# Altium schematic sheet Probe.SchDoc: FET Active Probe
size A4; DocumentNumber: 1; SheetNumber: 1; SheetTotal: 2
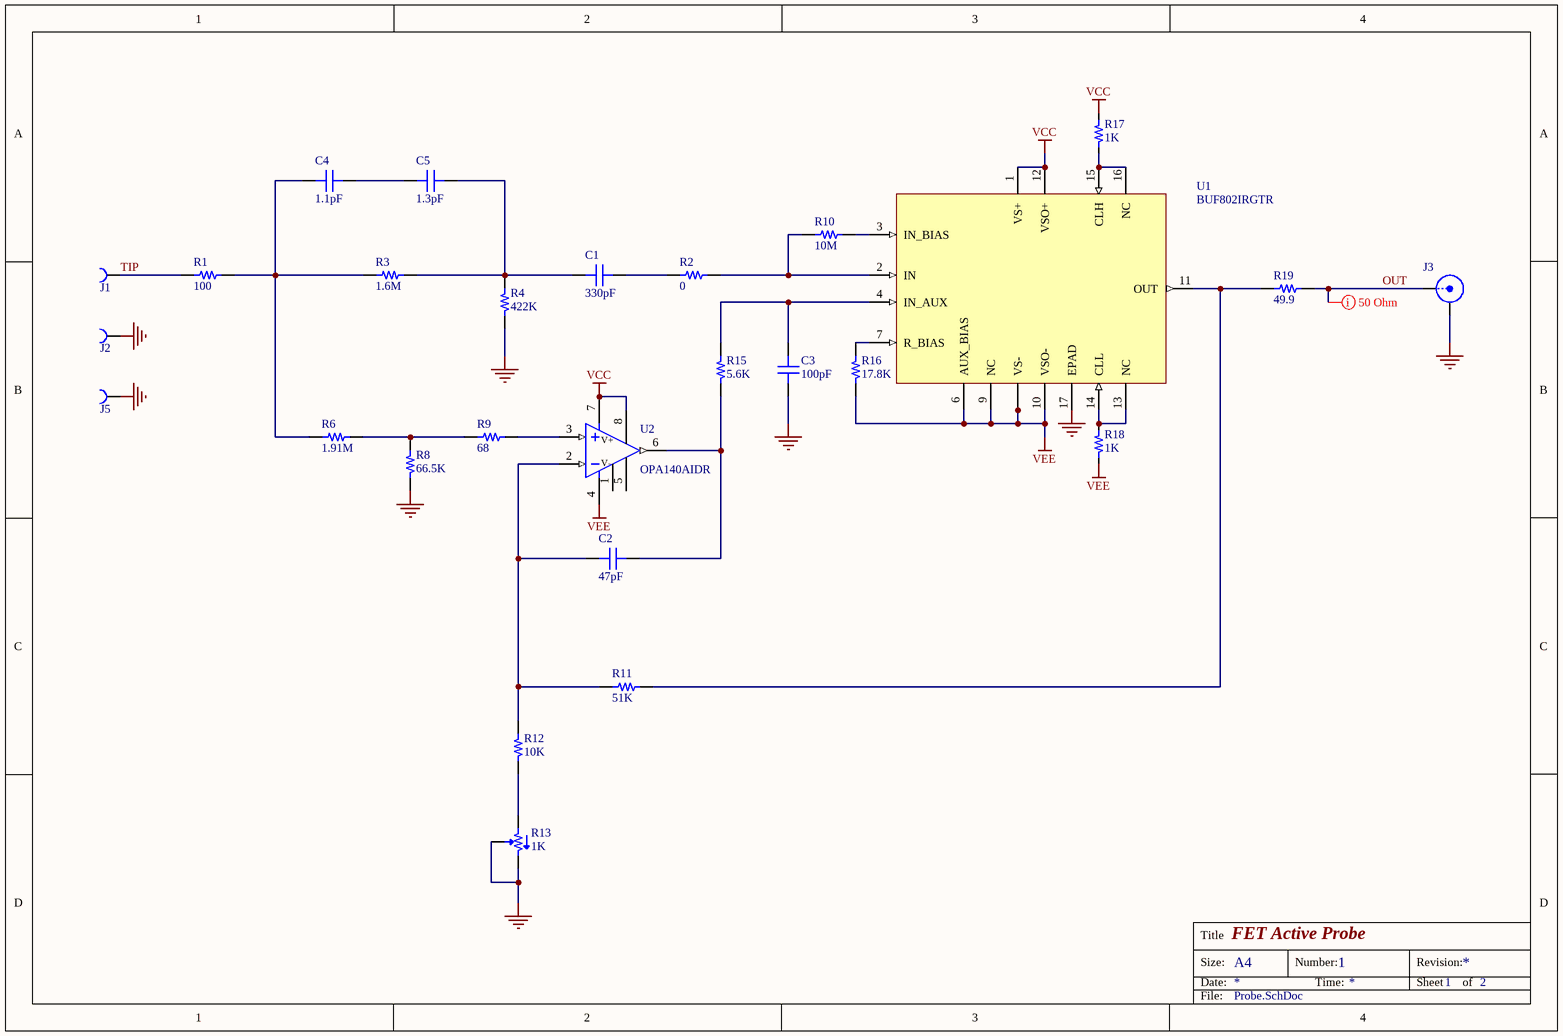
[diagram p0: Probe.SchDoc]

## Parts
C1  330pF  [CAP 0402/1005]
C2  47pF  [CAP 0402/1005]
C3  100pF  [CAP 0402/1005]
C4  1.1pF  [CAP 0402/1005 RF]
C5  1.3pF  [CAP 0402/1005 RF]
J1  0339-0-15-01-15-27-10-0  [MILL-MAX 0339]  (value not drawn)
J2  0339-0-15-01-15-27-10-0  [MILL-MAX 0339]  (value not drawn)
J3  CONN SMA JACK EDGE MNT  [60312202114513]  (value not drawn)
J5  0339-0-15-01-15-27-10-0  [MILL-MAX 0339]  (value not drawn)
R1  100  [RES 0402/1005]
R2  0  [RES 0402/1005]
R3  1.6M  [RES 0402/1005]
R4  422K  [RES 0402/1005]
R6  1.91M  [RES 0402/1005]
R8  66.5K  [RES 0402/1005]
R9  68  [RES 0402/1005]
R10  10M  [RES 0402/1005]
R11  51K  [RES 0402/1005]
R12  10K  [RES 0402/1005]
R13  1K  [BOURNS 3224W]
R15  5.6K  [RES 0402/1005]
R16  17.8K  [RES 0402/1005]
R17  1K  [RES 0402/1005]
R18  1K  [RES 0402/1005]
R19  49.9  [RES 0402/1005]
U1  BUF802IRGTR  [QFN50P305X305X100_HS-17N]
U2  OPA140AIDR  [TI SOIC-8 D]

## Nets
GND: C3.2 J2.1 J3.2(Y) J5.1 R4.2 R8.2 R13.2 R13.3 U1.17(EPAD)
VCC: R17.2 U1.1(VS+) U1.12(VSO+) U2.7(V+) U2.8
VEE: R16.2 R18.2 U1.5(VS-) U1.6(AUX_BIAS) U1.8(VS-) U1.9(NC) U1.10(VSO-) U2.4(V-)
OUT: J3.1(X) R19.2
TIP: J1.1 R1.1
NetC1_1: C1.1 C5.2 R3.2 R4.1
NetC1_2: C1.2 R2.1
NetC2_1: C2.1 R11.1 R12.1 U2.2(-IN)
NetC2_2: C2.2 R15.2 U2.6(OUT)
NetC3_1: C3.1 R15.1 U1.4(IN_AUX)
NetC4_1: C4.1 R1.2 R3.1 R6.1
NetC4_2: C4.2 C5.1
NetR2_2: R2.2 R10.1 U1.2(IN)
NetR6_2: R6.2 R8.1 R9.1
NetR9_2: R9.2 U2.3(+IN)
NetR10_2: R10.2 U1.3(IN_BIAS)
NetR11_2: R11.2 R19.1 U1.11(OUT)
NetR12_2: R12.2 R13.1
NetR16_1: R16.1 U1.7(R_BIAS)
NetR17_1: R17.1 U1.15(CLH) U1.16(NC)
NetR18_1: R18.1 U1.13(NC) U1.14(CLL)

Not connected (* = marked no-connect by the designer): U2 1 5(10)

## Layout directives
rule Width Constraint [Pref Impedance = 50.00ohms    Min Impedance = 50.00ohms    Max Impedance = 50.00ohms]: OUT

## Notes on the sheet
- Title
- Size:
- Date:
- A4
- Number:
- Time:
- Revision:
- Sheet
- of
- File:

## Library data of the parts
C1 = CM0293: CAP CER 330PF 50V NP0 0402; Manufacturer: Murata; Part Number: GRM1555C1H331JA01D; Tolerance: 5%; TemperatureRange: -55C ~ 125C; TemperatureCoefficient: C0G, NP0; Value: 330pF; PartId: CM0293; Supplier 1: Digi-Key; Supplier Part Number 1: 490-1295-2-ND; ComponentLink1Description: Datasheet; ComponentLink1URL: http://www.murata.com/~/media/webrenewal/support/library/catalog/products/capacitor/mlcc/c02e.ashx; ComponentLink2Description: Digi-Key listing; ComponentLink2URL: http://digikey.com/product-detail/en/GRM1555C1H331JA01D/490-1295-2-ND/587206; Voltage: 50V; Price: 0.009; Type: -; Device Package: 0402 (1005 Metric)
C2 = CM0224: CAP CER 47PF 50V NP0 0402; Manufacturer: Murata; Part Number: GRM1555C1H470FA01D; Tolerance: 1%; TemperatureRange: -55C ~ 125C; TemperatureCoefficient: C0G, NP0; Value: 47pF; PartId: CM0224; Supplier 1: Digi-Key; Supplier Part Number 1: 490-6241-2-ND; ComponentLink1Description: Datasheet; ComponentLink1URL: http://www.murata.com/~/media/webrenewal/support/library/catalog/products/capacitor/mlcc/c02e.ashx; ComponentLink2Description: Digi-Key listing; ComponentLink2URL: http://digikey.com/product-detail/en/GRM1555C1H470FA01D/490-6241-2-ND/3693991; Voltage: 50V; Price: 0.0133; Type: -; Device Package: 0402 (1005 Metric)
C3 = CM0248: CAP CER 100PF 50V NP0 0402; Manufacturer: Murata; Part Number: GRM1555C1H101FA01D; Tolerance: 1%; TemperatureRange: -55C ~ 125C; TemperatureCoefficient: C0G, NP0; Value: 100pF; PartId: CM0248; Supplier 1: Digi-Key; Supplier Part Number 1: 490-8180-2-ND; ComponentLink1Description: Datasheet; ComponentLink1URL: http://www.murata.com/~/media/webrenewal/support/library/catalog/products/capacitor/mlcc/c02e.pdf; ComponentLink2Description: Digi-Key Listing; ComponentLink2URL: https://www.digikey.com/product-detail/en/murata-electronics-north-america/GRM1555C1H101FA01D/490-8180-2-ND/3693919; Voltage: 50V; Price: 0.0092; Device Package: 0402 (1005 Metric)
C4 = CR1657: CAP CER 1.1PF +-0.05PF 50V NP0 0201; Part Number: GJM1555C1H1R1WB01D; Manufacturer: Murata; TemperatureRange: -55C ~ 125C; TemperatureCoefficient: C0G, NP0; Type: High Q, Low Loss; Tolerance: 0.05pF; Value: 1.1pF; PartId: CR1657; Supplier 1: Mouser; Supplier Part Number 1: 81-GJM1555C1H1R1WB01D; ComponentLink1Description: Datasheet; Voltage: 50V; Price: 0.02; Device Package: 0402 (1005 Metric); ComponentLink1URL: https://www.murata.com/en-eu/products/capacitor/ceramiccapacitor/overview/lineup/smd/gjm
C5 = CR1663: CAP CER 1.3PF +-0.05PF 50V NP0 0201; Part Number: GJM1555C1H1R3WB01D; Manufacturer: Murata; Tolerance: 0.05pF; TemperatureRange: -55C ~ 125C; TemperatureCoefficient: C0G, NP0; Type: High Q, Low Loss; Value: 1.3pF; PartId: CR1663; Supplier 1: Mouser; Supplier Part Number 1: 81-GJM1555C1H1R3WB01D; ComponentLink1Description: Datasheet; ComponentLink1URL: https://www.murata.com/en-eu/products/capacitor/ceramiccapacitor/overview/lineup/smd/gjm; Voltage: 50V; Price: 0.02; Device Package: 0402 (1005 Metric)
J1 J2 J5 = 0339-0-15-01-15-27-10-0: CONN PIN RCPT; Manufacturer: Mill-Max; Supplier 1: Digi-Key; Supplier Part Number 1: 0339-0-15-01-15-27-10-0-ND; Part Number: 0339-0-15-01-15-27-10-0; Stock 1: 989; Pricing 1: 1=1.42, 10=1.234, 25=1.1812, 50=1.155, 100=1.1025, 250=0.99748, 500=0.91874, 1000=0.7875, 2500=0.735 (USD); Contact Material: Copper; Contact Plating: Gold; Min Operating Temperature: -55°C; Max Operating Temperature: 125°C; Series: 0339; Packaging: Bulk; Termination: Solder; RoHS Compliant: No; ComponentLink1URL: https://www.mill-max.com/assets/pdfs/172.pdf?src-supplier=Digi-Key; ComponentLink1Description: https://www.mill-max.com/assets/pdfs/172.pdf?src-supplier=Digi-Key; ComponentLink2URL: https://datasheet.octopart.com/0339-0-15-01-15-27-10-0-Mill-Max-datasheet-26446830.pdf?src-supplier=Future+Electronics; ComponentLink2Description: https://datasheet.octopart.com/0339-0-15-01-15-27-10-0-Mill-Max-datasheet-26446830.pdf?src-supplier=Future+Electronics; ComponentLink3URL: http://www.mouser.com/ds/2/273/172M-276194.pdf?src-supplier=Mouser; ComponentLink3Description: http://www.mouser.com/ds/2/273/172M-276194.pdf?src-supplier=Mouser; ComponentLink4URL: https://datasheet.octopart.com/0339-0-15-01-15-27-10-0-Mill-Max-datasheet-155663258.pdf?src-supplier=Sager+Electronics; ComponentLink4Description: https://datasheet.octopart.com/0339-0-15-01-15-27-10-0-Mill-Max-datasheet-155663258.pdf?src-supplier=Sager+Electronics; Supplier 2: Mouser; Supplier Part Number 2: 575-0339015011527100
J3 = CRF016: WR-SMA Connector, PCB End Launch Jack, 6.35SQ Flange Flat Tab 1.6mm, DC~18GHz, 50Ohm; Manufacturer: Wurth; PartId: CRF016; Part Number: 60312202114513; ComponentLink1Description: Datasheet; ComponentLink1URL: https://www.we-online.com/redexpert/spec/603122021; Connector Type: SMA Jack; Mounting Technology: End Launch; Impedance: 50Ohm; Operating Temperature: -65C ~ 165C; Orientation: Straight; Supplier 1: Mouser; Supplier Part Number 1: 710-60312202114513; Supplier 2: Digi-Key; Supplier Part Number 2: 732-13844-ND
R1 = RC1250: RES SMD 100 OHM 1% 1/16W 0402; Part Number: RC0402FR-07100RL; Manufacturer: Yageo; TemperatureRange: -55C ~ 155C; TemperatureCoefficient: 100ppm/C; PowerRating: 0.0625W, 1/16W; Value: 100; PartId: RC1250; Supplier 1: Mouser; Supplier Part Number 1: 603-RC0402FR-07100RL; ComponentLink1Description: Datasheet; ComponentLink1URL: http://www.yageo.com/NewPortal/yageodocoutput?fileName=/pdf/R-Chip/PYu-RC_Group_51_RoHS_L_9.pdf; Tolerance: 1%; Price: 0.0043; Type: Thick Film; Device Package: 0402 (1005 Metric)
R2 = RC0971: RES SMD 0 OHM 5% 1/16W 0402; Part Number: RC0402JR-070RL; Manufacturer: Yageo; TemperatureRange: -55C ~ 155C; TemperatureCoefficient: 100ppm/C; PowerRating: 0.0625W, 1/16W; Value: 0; PartId: RC0971; Supplier 1: Mouser; Supplier Part Number 1: 603-RC0402JR-070RL; ComponentLink1Description: Datasheet; ComponentLink1URL: http://www.yageo.com/NewPortal/yageodocoutput?fileName=/pdf/R-Chip/PYu-RC_Group_51_RoHS_L_9.pdf; Tolerance: 5%; Price: 0.0043; Type: Thick Film; Device Package: 0402 (1005 Metric)
R3 = RC1837: RES SMD 1.6M OHM 1% 1/16W 0402; Part Number: RC0402FR-071M6L; Manufacturer: Yageo; TemperatureRange: -55C ~ 155C; TemperatureCoefficient: 100ppm/C; PowerRating: 0.0625W, 1/16W; Value: 1.6M; PartId: RC1837; Supplier 1: Mouser; Supplier Part Number 1: 603-RC0402FR-071M6L; ComponentLink1Description: Datasheet; ComponentLink1URL: http://www.yageo.com/NewPortal/yageodocoutput?fileName=/pdf/R-Chip/PYu-RC_Group_51_RoHS_L_9.pdf; Tolerance: 1%; Price: 0.0043; Type: Thick Film; Device Package: 0402 (1005 Metric)
R4 = RC1757: RES SMD 422K OHM 1% 1/16W 0402; Part Number: RC0402FR-07422KL; Manufacturer: Yageo; TemperatureRange: -55C ~ 155C; TemperatureCoefficient: 100ppm/C; PowerRating: 0.0625W, 1/16W; Value: 422K; PartId: RC1757; Supplier 1: Mouser; Supplier Part Number 1: 603-RC0402FR-07422KL; ComponentLink1Description: Datasheet; ComponentLink1URL: http://www.yageo.com/NewPortal/yageodocoutput?fileName=/pdf/R-Chip/PYu-RC_Group_51_RoHS_L_9.pdf; Tolerance: 1%; Price: 0.0043; Type: Thick Film; Device Package: 0402 (1005 Metric)
R6 = RC1847: RES SMD 1.91M OHM 1% 1/16W 0402; Part Number: RC0402FR-071M91L; Manufacturer: Yageo; TemperatureRange: -55C ~ 155C; TemperatureCoefficient: 100ppm/C; PowerRating: 0.0625W, 1/16W; Value: 1.91M; PartId: RC1847; Supplier 1: Mouser; Supplier Part Number 1: 603-RC0402FR-071M91L; ComponentLink1Description: Datasheet; ComponentLink1URL: http://www.yageo.com/NewPortal/yageodocoutput?fileName=/pdf/R-Chip/PYu-RC_Group_51_RoHS_L_9.pdf; Tolerance: 1%; Price: 0.0043; Type: Thick Film; Device Package: 0402 (1005 Metric)
R8 = RC1647: RES SMD 66.5K OHM 1% 1/16W 0402; Part Number: RC0402FR-0766K5L; Manufacturer: Yageo; TemperatureRange: -55C ~ 155C; TemperatureCoefficient: 100ppm/C; PowerRating: 0.0625W, 1/16W; Value: 66.5K; PartId: RC1647; Supplier 1: Mouser; Supplier Part Number 1: 603-RC0402FR-0766K5L; ComponentLink1Description: Datasheet; ComponentLink1URL: http://www.yageo.com/NewPortal/yageodocoutput?fileName=/pdf/R-Chip/PYu-RC_Group_51_RoHS_L_9.pdf; Tolerance: 1%; Price: 0.0043; Type: Thick Film; Device Package: 0402 (1005 Metric)
R9 = RC1227: RES SMD 68 OHM 1% 1/16W 0402; Part Number: RC0402FR-0768RL; Manufacturer: Yageo; TemperatureRange: -55C ~ 155C; TemperatureCoefficient: 100ppm/C; PowerRating: 0.0625W, 1/16W; Value: 68; PartId: RC1227; Supplier 1: Mouser; Supplier Part Number 1: 603-RC0402FR-0768RL; ComponentLink1Description: Datasheet; ComponentLink1URL: http://www.yageo.com/NewPortal/yageodocoutput?fileName=/pdf/R-Chip/PYu-RC_Group_51_RoHS_L_9.pdf; Tolerance: 1%; Price: 0.0043; Type: Thick Film; Device Package: 0402 (1005 Metric)
R10 = RC1949: RES SMD 10M OHM 1% 1/16W 0402; Part Number: RC0402FR-0710ML; Manufacturer: Yageo; TemperatureRange: -55C ~ 155C; TemperatureCoefficient: 100ppm/C; PowerRating: 0.0625W, 1/16W; Value: 10M; PartId: RC1949; Supplier 1: Mouser; Supplier Part Number 1: 603-RC0402FR-0710ML; ComponentLink1Description: Datasheet; ComponentLink1URL: http://www.yageo.com/NewPortal/yageodocoutput?fileName=/pdf/R-Chip/PYu-RC_Group_51_RoHS_L_9.pdf; Tolerance: 1%; Price: 0.0043; Type: Thick Film; Device Package: 0402 (1005 Metric)
R11 = RC1630: RES SMD 51K OHM 1% 1/16W 0402; Part Number: RC0402FR-0751KL; Manufacturer: Yageo; TemperatureRange: -55C ~ 155C; TemperatureCoefficient: 100ppm/C; PowerRating: 0.0625W, 1/16W; Value: 51K; PartId: RC1630; Supplier 1: Mouser; Supplier Part Number 1: 603-RC0402FR-0751KL; ComponentLink1Description: Datasheet; ComponentLink1URL: http://www.yageo.com/NewPortal/yageodocoutput?fileName=/pdf/R-Chip/PYu-RC_Group_51_RoHS_L_9.pdf; Tolerance: 1%; Price: 0.0043; Type: Thick Film; Device Package: 0402 (1005 Metric)
R12 = RC1531: RES SMD 10K OHM 1% 1/16W 0402; Part Number: RC0402FR-0710KL; Manufacturer: Yageo; TemperatureRange: -55C ~ 155C; TemperatureCoefficient: 100ppm/C; PowerRating: 0.0625W, 1/16W; Value: 10K; PartId: RC1531; Supplier 1: Mouser; Supplier Part Number 1: 603-RC0402FR-0710KL; ComponentLink1Description: Datasheet; ComponentLink1URL: http://www.yageo.com/NewPortal/yageodocoutput?fileName=/pdf/R-Chip/PYu-RC_Group_51_RoHS_L_9.pdf; Tolerance: 1%; Price: 0.0043; Type: Thick Film; Device Package: 0402 (1005 Metric)
R13 = PBT084: TRIMMER 1K OHM 0.25W J LEAD TOP; Manufacturer: Bourns; Part Number: 3224W-1-102E; Number of Turns: 12; Tolerance: 10%; TemperatureRange: -65C ~ 150C; TemperatureCoefficient: 100ppm/C; PowerRating: 0.25W, 1/4W; Adjustment Type: Top Adjustment; Resistive Material: Cermet; Supplier 1: Mouser; Supplier Part Number 1: 652-3224W-1-102E; ComponentLink1URL: https://www.bourns.com/docs/Product-Datasheets/3224.pdf; ComponentLink1Description: Datasheet; Supplier 2: Digi-Key; Supplier Part Number 2: 3224W-1-102ETR-ND; Value: 1K; PartId: PBT084; Price: 3.278; Device Package: Rectangular - 0.189" x 0.138" Face x 0.209" H (4.80mm x 3.50mm x 5.30mm); Mounting Type: Surface Mount
R15 = RC1496: RES SMD 5.6K OHM 1% 1/16W 0402; Part Number: RC0402FR-075K6L; Manufacturer: Yageo; TemperatureRange: -55C ~ 155C; TemperatureCoefficient: 100ppm/C; PowerRating: 0.0625W, 1/16W; Value: 5.6K; PartId: RC1496; Supplier 1: Mouser; Supplier Part Number 1: 603-RC0402FR-075K6L; ComponentLink1Description: Datasheet; ComponentLink1URL: http://www.yageo.com/NewPortal/yageodocoutput?fileName=/pdf/R-Chip/PYu-RC_Group_51_RoHS_L_9.pdf; Tolerance: 1%; Price: 0.0043; Type: Thick Film; Device Package: 0402 (1005 Metric)
R16 = RC1562: RES SMD 17.8K OHM 1% 1/16W 0402; Part Number: RC0402FR-0717K8L; Manufacturer: Yageo; TemperatureRange: -55C ~ 155C; TemperatureCoefficient: 100ppm/C; PowerRating: 0.0625W, 1/16W; Value: 17.8K; PartId: RC1562; Supplier 1: Mouser; Supplier Part Number 1: 603-RC0402FR-0717K8L; ComponentLink1Description: Datasheet; ComponentLink1URL: http://www.yageo.com/NewPortal/yageodocoutput?fileName=/pdf/R-Chip/PYu-RC_Group_51_RoHS_L_9.pdf; Tolerance: 1%; Price: 0.0043; Type: Thick Film; Device Package: 0402 (1005 Metric)
R17 R18 = RC1389: RES SMD 1K OHM 1% 1/16W 0402; Part Number: RC0402FR-071KL; Manufacturer: Yageo; TemperatureRange: -55C ~ 155C; TemperatureCoefficient: 100ppm/C; PowerRating: 0.0625W, 1/16W; Value: 1K; PartId: RC1389; Supplier 1: Mouser; Supplier Part Number 1: 603-RC0402FR-071KL; ComponentLink1Description: Datasheet; ComponentLink1URL: http://www.yageo.com/NewPortal/yageodocoutput?fileName=/pdf/R-Chip/PYu-RC_Group_51_RoHS_L_9.pdf; Tolerance: 1%; Price: 0.0043; Type: Thick Film; Device Package: 0402 (1005 Metric)
R19 = RC1206: RES SMD 49.9 OHM 1% 1/16W 0402; Part Number: RC0402FR-0749R9L; Manufacturer: Yageo; TemperatureRange: -55C ~ 155C; TemperatureCoefficient: 100ppm/C; PowerRating: 0.0625W, 1/16W; Value: 49.9; PartId: RC1206; Supplier 1: Mouser; Supplier Part Number 1: 603-RC0402FR-0749R9L; ComponentLink1Description: Datasheet; ComponentLink1URL: http://www.yageo.com/NewPortal/yageodocoutput?fileName=/pdf/R-Chip/PYu-RC_Group_51_RoHS_L_9.pdf; Tolerance: 1%; Price: 0.0043; Type: Thick Film; Device Package: 0402 (1005 Metric)
U1 = UO0077: IC AMP WIDE BANDWIDTH 16VQFN; Manufacturer: TI; PartId: UO0077; Part Number: BUF802IRGTR; Supplier 1: Digi-Key; Supplier Part Number 1: 296-BUF802IRGTRCT-ND; Supplier 2: Mouser; Supplier Part Number 2: 595-BUF802IRGTR; ComponentLink1Description: Datasheet; ComponentLink1URL: https://www.ti.com/lit/ds/symlink/buf802.pdf; Price: 6; Type: OPAMP; Device Package: 16-VQFN; Operating Temperature: -40C ~ 125C
U2 = UO0076: IC OPAMP JFET 1CIRC 8SOIC; Manufacturer: TI; PartId: UO0076; Part Number: OPA140AIDR; Supplier 1: Digi-Key; Supplier Part Number 1: 296-43606-2-ND; Supplier 2: Mouser; Supplier Part Number 2: 595-OPA140AIDR; ComponentLink1Description: Datasheet; ComponentLink1URL: https://www.ti.com/lit/ds/symlink/opa4140.pdf; Price: 4; Type: OPAMP; Device Package: 8-SOIC; Operating Temperature: -40C ~ 125C